# Altium project eBox-SPARK_1.2.PrjPcb
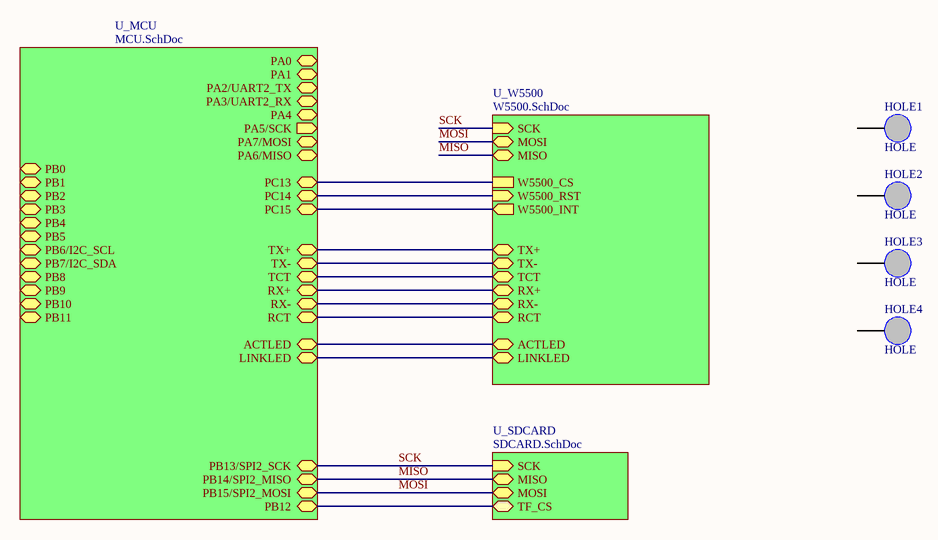
[diagram p0: main.SchDoc]
4 sheets, 69 parts. Net scope: hierarchical (ports join the sheet entries above them; power ports are global).
Board files: ebox-SPARK.PcbDoc, ebox-SPARK-拼板.PcbDoc
Sheets:
  main.SchDoc
    U_MCU = MCU.SchDoc
    U_SDCARD = SDCARD.SchDoc
    U_W5500 = W5500.SchDoc

## Sheet main.SchDoc
size A4

### Parts
HOLE1  HOLE  [M2.5]
HOLE2  HOLE  [M2.5]
HOLE3  HOLE  [M2.5]
HOLE4  HOLE  [M2.5]

### Sub-sheets
U_MCU = MCU.SchDoc: PA5/SCK (out), PB0, PB1, PB2, PB3, PB4, PB5, PB6/I2C_SCL, PB7/I2C_SDA, PB8, PB9, PB10, PB11, PB12, PA0, PA1, PA2/UART2_TX, PA3/UART2_RX, PA4, PA7/MOSI, PA6/MISO, LINKLED, PB13/SPI2_SCK, PB14/SPI2_MISO, PB15/SPI2_MOSI, TX-, TX+, RX+, RX-, PC13, PC14, PC15, RCT, TCT, ACTLED
U_SDCARD = SDCARD.SchDoc: TF_CS (bidir), SCK (in), MOSI, MISO
U_W5500 = W5500.SchDoc: W5500_INT (out), W5500_CS, W5500_RST (in), SCK (in), MOSI, MISO, LINKLED, TX-, TX+, RX-, RX+, TCT, RCT, ACTLED

### Nets
ACTLED: sheet U_MCU/ACTLED, sheet U_W5500/ACTLED
LINKLED: sheet U_MCU/LINKLED, sheet U_W5500/LINKLED
MISO: sheet U_MCU/PB14/SPI2_MISO, sheet U_SDCARD/MISO, sheet U_W5500/MISO
MOSI: sheet U_MCU/PB15/SPI2_MOSI, sheet U_SDCARD/MOSI, sheet U_W5500/MOSI
PB12: sheet U_MCU/PB12, sheet U_SDCARD/TF_CS
PC13: sheet U_MCU/PC13, sheet U_W5500/W5500_CS
PC14: sheet U_MCU/PC14, sheet U_W5500/W5500_RST
PC15: sheet U_MCU/PC15, sheet U_W5500/W5500_INT
RCT: sheet U_MCU/RCT, sheet U_W5500/RCT
SCK: sheet U_MCU/PB13/SPI2_SCK, sheet U_SDCARD/SCK, sheet U_W5500/SCK  [project net PB13]
TCT: sheet U_MCU/TCT, sheet U_W5500/TCT
TXN: sheet U_MCU/TX-, sheet U_W5500/TX-
TXP: sheet U_MCU/TX+, sheet U_W5500/TX+
NetC19_1: sheet U_MCU/RX+, sheet U_W5500/RX+
NetC20_1: sheet U_MCU/RX-, sheet U_W5500/RX-

Not connected (* = marked no-connect by the designer): HOLE1 0; HOLE2 0; HOLE3 0; HOLE4 0

### Library data of the parts
HOLE1-HOLE4 = HOLE: standard screw

## Sheet MCU.SchDoc
size A4
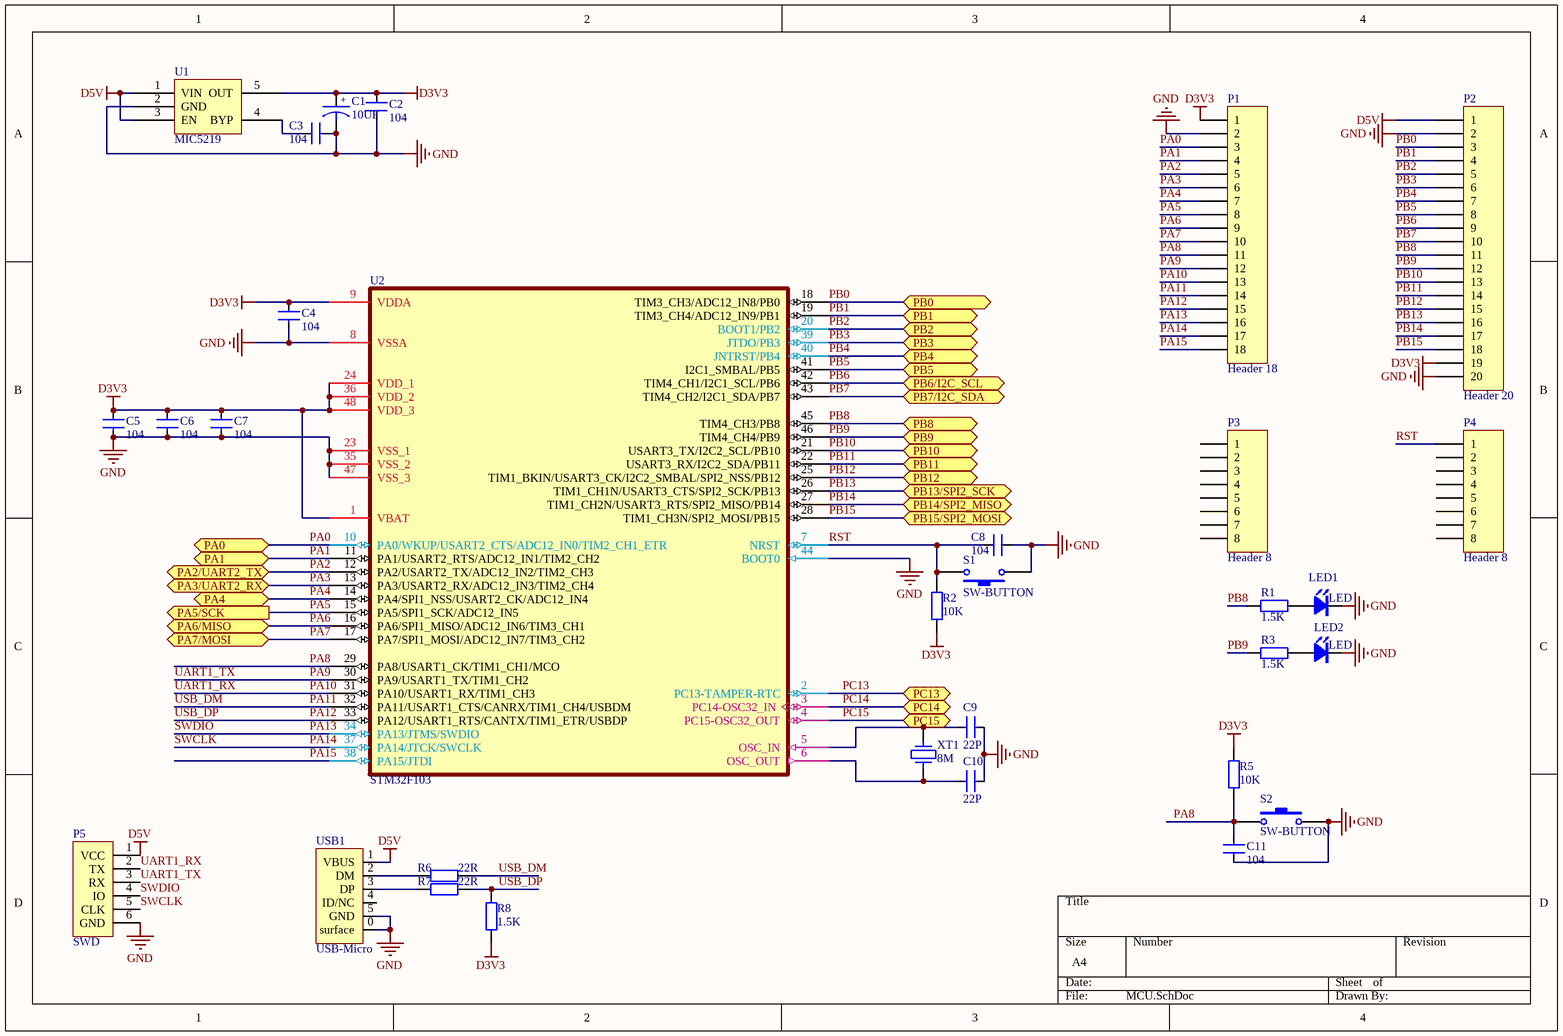
[diagram p1: MCU.SchDoc]

### Parts
C1  10UF  [3216C]
C2  104  [0603C]
C3  104  [0603C]
C4  104  [0603C]
C5  104  [0603C]
C6  104  [0603C]
C7  104  [0603C]
C8  104  [0603C]
C9  22P  [0603C]
C10  22P  [0603C]
C11  104  [0603C]
LED1  LED  [0805D]
LED2  LED  [0805D]
P1  Header 18  [HDR1X18]
P2  Header 20  [HDR1X20]
P3  Header 8  [HDR1X8]
P4  Header 8  [HDR1X8]
P5  SWD  [HDR1X6]
R1  1.5K  [0603R]
R2  10K  [0603R]
R3  1.5K  [0603R]
R5  10K  [0603R]
R6  22R  [0603R]
R7  22R  [0603R]
R8  1.5K  [0603R]
S1  SW-BUTTON  [SW-KEY]
S2  SW-BUTTON  [SW-KEY]
U1  MIC5219  [SOT23-5]
U2  STM32F103  [LQFP48]
USB1  USB-Micro  [USB-Micro-2]
XT1  8M  [5032]

### Ports
PA0, PA1, PA2/UART2_TX, PA3/UART2_RX, PA4, PA5/SCK (out), PA6/MISO, PA7/MOSI, PB0, PB1, PB2, PB3, PB4, PB5, PB6/I2C_SCL, PB7/I2C_SDA, PB8, PB9, PB10, PB11, PB12, PB13/SPI2_SCK, PB14/SPI2_MISO, PB15/SPI2_MOSI, PC13, PC14, PC15

### Nets
D3V3: C1.1 C2.2 C4.2 C5.2 C6.1 C7.2 P1.1 P2.19 R2.1 R5.1 R8.2 U1.5(OUT) U2.1(VBAT) U2.9(VDDA) U2.24(VDD_1) U2.36(VDD_2) U2.48(VDD_3)
D5V: P2.1 P5.1(VCC) U1.1(VIN) U1.3(EN) USB1.1(VBUS)
GND: C1.2 C2.1 C3.2 C4.1 C5.1 C6.2 C7.1 C8.2 C9.2 C10.2 C11.1 LED1.K LED2.K P1.2 P2.2 P2.20 P5.6(GND) S1.1 S2.2 U1.2(GND) U2.8(VSSA) U2.23(VSS_1) U2.35(VSS_2) U2.44(BOOT0) U2.47(VSS_3) USB1.0(surface) USB1.5(GND)
PA0: P1.3 U2.10(PA0/WKUP/USART2_CTS/ADC12_IN0/TIM2_CH1_ETR) ; port PA0
PA1: P1.4 U2.11(PA1/USART2_RTS/ADC12_IN1/TIM2_CH2) ; port PA1
PA2: P1.5 U2.12(PA2/USART2_TX/ADC12_IN2/TIM2_CH3) ; port PA2/UART2_TX
PA3: P1.6 U2.13(PA3/USART2_RX/ADC12_IN3/TIM2_CH4) ; port PA3/UART2_RX
PA4: P1.7 U2.14(PA4/SPI1_NSS/USART2_CK/ADC12_IN4) ; port PA4
PA5: P1.8 U2.15(PA5/SPI1_SCK/ADC12_IN5) ; port PA5/SCK
PA6: P1.9 U2.16(PA6/SPI1_MISO/ADC12_IN6/TIM3_CH1) ; port PA6/MISO
PA7: P1.10 U2.17(PA7/SPI1_MOSI/ADC12_IN7/TIM3_CH2) ; port PA7/MOSI
PA8: C11.2 P1.11 R5.2 S2.1 U2.29(PA8/USART1_CK/TIM1_CH1/MCO)
PA9: P1.12 P5.3(RX) U2.30(PA9/USART1_TX/TIM1_CH2)  [also labelled UART1_TX]
PA10: P1.13 P5.2(TX) U2.31(PA10/USART1_RX/TIM1_CH3)  [also labelled UART1_RX]
PA11: P1.14 R6.1 U2.32(PA11/USART1_CTS/CANRX/TIM1_CH4/USBDM)  [also labelled USB_DM]
PA12: P1.15 R7.1 R8.1 U2.33(PA12/USART1_RTS/CANTX/TIM1_ETR/USBDP)  [also labelled USB_DP]
PA13: P1.16 P5.4(IO) U2.34(PA13/JTMS/SWDIO)  [also labelled SWDIO]
PA14: P1.17 P5.5(CLK) U2.37(PA14/JTCK/SWCLK)  [also labelled SWCLK]
PA15: P1.18 U2.38(PA15/JTDI)
PB0: P2.3 U2.18(TIM3_CH3/ADC12_IN8/PB0) ; port PB0
PB1: P2.4 U2.19(TIM3_CH4/ADC12_IN9/PB1) ; port PB1
PB2: P2.5 U2.20(BOOT1/PB2) ; port PB2
PB3: P2.6 U2.39(JTDO/PB3) ; port PB3
PB4: P2.7 U2.40(JNTRST/PB4) ; port PB4
PB5: P2.8 U2.41(I2C1_SMBAL/PB5) ; port PB5
PB6: P2.9 U2.42(TIM4_CH1/I2C1_SCL/PB6) ; port PB6/I2C_SCL
PB7: P2.10 U2.43(TIM4_CH2/I2C1_SDA/PB7) ; port PB7/I2C_SDA
PB8: P2.11 R1.1 U2.45(TIM4_CH3/PB8) ; port PB8
PB9: P2.12 R3.1 U2.46(TIM4_CH4/PB9) ; port PB9
PB10: P2.13 U2.21(USART3_TX/I2C2_SCL/PB10) ; port PB10
PB11: P2.14 U2.22(USART3_RX/I2C2_SDA/PB11) ; port PB11
PB12: P2.15 U2.25(TIM1_BKIN/USART3_CK/I2C2_SMBAL/SPI2_NSS/PB12) ; port PB12
PB13: P2.16 U2.26(TIM1_CH1N/USART3_CTS/SPI2_SCK/PB13) ; port PB13/SPI2_SCK
PB14: P2.17 U2.27(TIM1_CH2N/USART3_RTS/SPI2_MISO/PB14) ; port PB14/SPI2_MISO  [project net MISO]
PB15: P2.18 U2.28(TIM1_CH3N/SPI2_MOSI/PB15) ; port PB15/SPI2_MOSI  [project net MOSI]
PC13: U2.2(PC13-TAMPER-RTC) ; port PC13
PC14: U2.3(PC14-OSC32_IN) ; port PC14
PC15: U2.4(PC15-OSC32_OUT) ; port PC15
RST: C8.1 P4.1 R2.2 S1.2 U2.7(NRST)
NetC3_1: C3.1 U1.4(BYP)
NetC9_1: C9.1 U2.5(OSC_IN) XT1.1
NetC10_1: C10.1 U2.6(OSC_OUT) XT1.2
NetLED1_A: LED1.A R1.2
NetLED2_A: LED2.A R3.2
NetR6_2: R6.2 USB1.2(DM)
NetR7_2: R7.2 USB1.3(DP)

Not connected (* = marked no-connect by the designer): P3 1 2 3 4 5 6 7 8; P4 2 3 4 5 6 7 8; USB1 4(ID/NC)

### Notes on the sheet
- Labels drawn without touching a wire or pin: ENC1, ENC2, ENC3
- (in symbol CAP-T) +

### Library data of the parts
C1 = CAP-T: 钽电容
C2-C11 = CAP: 普通小电容
P1 = Header 18: Header, 18-Pin; LatestRevisionDate: 17-Jul-2002; LatestRevisionNote: Re-released for DXP Platform.; Publisher: Altium Limited
P2 = Header 20: Header, 20-Pin; LatestRevisionDate: 17-Jul-2002; LatestRevisionNote: Re-released for DXP Platform.; Publisher: Altium Limited
P3 P4 = Header 8: Header, 8-Pin; LatestRevisionDate: 17-Jul-2002; LatestRevisionNote: Re-released for DXP Platform.; Publisher: Altium Limited
P5 = SWD: 单片机端
R1-R3 R5-R8 = RES: 普通电阻
USB1 = USB-Micro: USB 1.1, Right Angle, SMT, A Type, Plug, 4 Position, Natural; ContactMaterial: Brass; ContactPlating: Gold (30) over Nickel (50); PCB_Layout: Complies with manufacturer's recommendation.; DrillSize: Corresponds to nominal value.; PanelGround: Without; Published: 15-Jul-2004; DatasheetDocument: 21-Jan-2003; PackageDocument: 21-Jan-2003; PackageReference: 1470695A; Publisher: Altium Limited; HousingMaterial: Thermoplastic; ComponentLink1Description: Manufacturer Link; ComponentLink1URL: http://www.tycoelectronics.com/; ComponentLink2Description: Packaging Specification; ComponentLink2URL: http://ecommas.tycoelectronics.com/commerce/DocumentDelivery/DDEController?Action=showdoc&DocId=Customer+Drawing%7F1470695%7FO%7Fpdf%7FEnglish%7FC_1470695_O.pdf
XT1 = XT: 晶振

## Sheet SDCARD.SchDoc
size A4
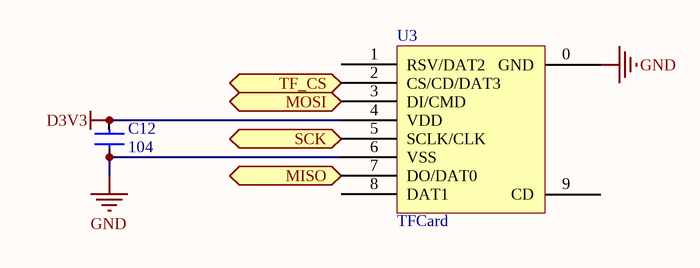
[diagram p2: SDCARD.SchDoc]

### Parts
C12  104  [0603C]
U3  TFCard  [TF-2]

### Ports
MISO, MOSI, SCK (in), TF_CS (bidir)

### Nets
D3V3: C12.1 U3.4(VDD)
GND: C12.2 U3.0(GND) U3.6(VSS)
MISO: U3.7(DO/DAT0) ; port MISO
MOSI: U3.3(DI/CMD) ; port MOSI
PB12: U3.2(CS/CD/DAT3) ; port TF_CS
PB13: U3.5(SCLK/CLK) ; port SCK

Not connected (* = marked no-connect by the designer): U3 1(RSV/DAT2) 8(DAT1) 9(CD)

### Library data of the parts
C12 = CAP: 普通小电容

## Sheet W5500.SchDoc
size A4
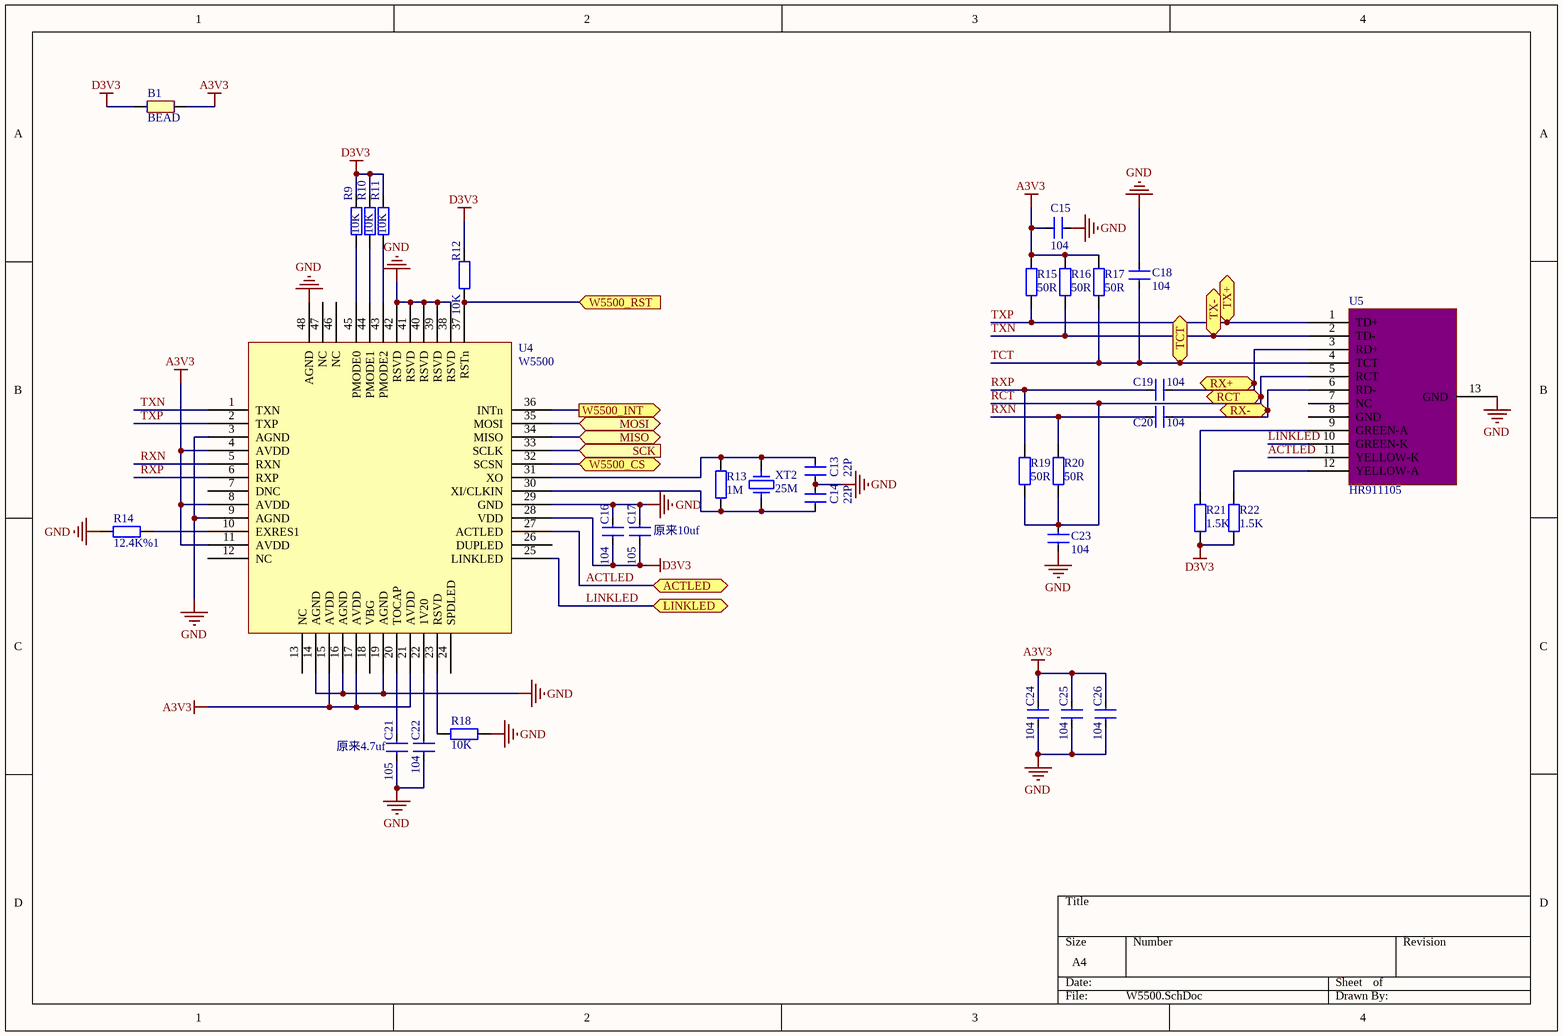
[diagram p3: W5500.SchDoc]

### Parts
B1  BEAD  [0603L]
C13  22P  [0603C]
C14  22P  [0603C]
C15  104  [0603C]
C16  104  [0603C]
C17  105  [0603C]
C18  104  [0603C]
C19  104  [0603C]
C20  104  [0603C]
C21  105  [0603C]
C22  104  [0603C]
C23  104  [0603C]
C24  104  [0603C]
C25  104  [0603C]
C26  104  [0603C]
R9  10K  [0603R]
R10  10K  [0603R]
R11  10K  [0603R]
R12  10K  [0603R]
R13  1M  [0603R]
R14  12.4K%1  [0603R]
R15  50R  [0603R]
R16  50R  [0603R]
R17  50R  [0603R]
R18  10K  [0603R]
R19  50R  [0603R]
R20  50R  [0603R]
R21  1.5K  [0603R]
R22  1.5K  [0603R]
U4  W5500  [LQFP48]
U5  HR911105  [HR911105A]
XT2  25M  [5032]

### Ports
ACTLED, LINKLED, MISO, MOSI, RCT, RX+, RX-, SCK (in), TCT, TX+, TX-, W5500_CS, W5500_INT (out), W5500_RST (in)

### Nets
A3V3: B1.2 C15.1 C24.2 C25.2 C26.2 R15.2 R16.2 R17.2 U4.4(AVDD) U4.8(AVDD) U4.11(AVDD) U4.15(AVDD) U4.17(AVDD) U4.21(AVDD)
D3V3: B1.1 C16.1 C17.1 R9.2 R10.2 R11.2 R12.2 R21.1 R22.1 U4.28(VDD)
GND: C13.1 C14.2 C15.2 C16.2 C17.2 C18.1 C21.1 C22.1 C23.2 C24.1 C25.1 C26.1 R14.2 R18.1 U4.3(AGND) U4.9(AGND) U4.14(AGND) U4.16(AGND) U4.19(AGND) U4.29(GND) U4.38(RSVD) U4.39(RSVD) U4.40(RSVD) U4.41(RSVD) U4.42(RSVD) U4.48(AGND) U5.13(GND)
ACTLED: U4.27(ACTLED) U5.11(YELLOW-K) ; port ACTLED
LINKLED: U4.25(LINKLED) U5.10(GREEN-K) ; port LINKLED
MISO: U4.34(MISO) ; port MISO
MOSI: U4.35(MOSI) ; port MOSI
PB13: U4.33(SCLK) ; port SCK
PC13: U4.32(SCSN) ; port W5500_CS
PC14: R12.1 U4.37(RSTn) ; port W5500_RST
PC15: U4.36(INTn) ; port W5500_INT
RCT: C23.1 R19.2 R20.2 U5.5(RCT) ; port RCT
RXN: C20.2 R20.1 U4.5(RXN)
RXP: C19.2 R19.1 U4.6(RXP)
TCT: C18.2 R17.1 U5.4(TCT) ; port TCT
TXN: R16.1 U4.1(TXN) U5.2(TD-) ; port TX-
TXP: R15.1 U4.2(TXP) U5.1(TD+) ; port TX+
NetC13_2: C13.2 R13.2 U4.31(XO) XT2.2
NetC14_1: C14.1 R13.1 U4.30(XI/CLKIN) XT2.1
NetC19_1: C19.1 U5.3(RD+) ; port RX+
NetC20_1: C20.1 U5.6(RD-) ; port RX-
NetC21_2: C21.2 U4.20(TOCAP)
NetC22_2: C22.2 U4.22(1V20)
NetR9_1: R9.1 U4.45(PMODE0)
NetR10_1: R10.1 U4.44(PMODE1)
NetR11_1: R11.1 U4.43(PMODE2)
NetR14_1: R14.1 U4.10(EXRES1)
NetR18_2: R18.2 U4.23(RSVD)
NetR21_2: R21.2 U5.9(GREEN-A)
NetR22_2: R22.2 U5.12(YELLOW-A)

Not connected (* = marked no-connect by the designer): U4 7(DNC) 12(NC) 13(NC) 18(VBG) 24(SPDLED) 26(DUPLED) 46(NC) 47(NC); U5 7(NC) 8(GND)

### Notes on the sheet
- (near C17) 原来10uf
- (near C21) 原来4.7uf

### Library data of the parts
B1 = BEAD: 磁珠
C13-C26 = CAP: 普通小电容
R9-R22 = RES: 普通电阻
XT2 = XT: 晶振

## Nets that join several sheets
D3V3: MCU (17 pins), SDCARD (C12.1 U3.4), W5500 (10 pins)
GND: MCU (27 pins), SDCARD (C12.2 U3.0 U3.6), W5500 (27 pins)
MISO: MCU (P2.17 U2.27), SDCARD (U3.7), W5500 (U4.34)
MOSI: MCU (P2.18 U2.28), SDCARD (U3.3), W5500 (U4.35)
PB12: MCU (P2.15 U2.25), SDCARD (U3.2)
PB13: MCU (P2.16 U2.26), SDCARD (U3.5), W5500 (U4.33)
PC13: MCU (U2.2), W5500 (U4.32)
PC14: MCU (U2.3), W5500 (R12.1 U4.37)
PC15: MCU (U2.4), W5500 (U4.36)